# EAGLE schematic board (EAGLE 9.6.2)
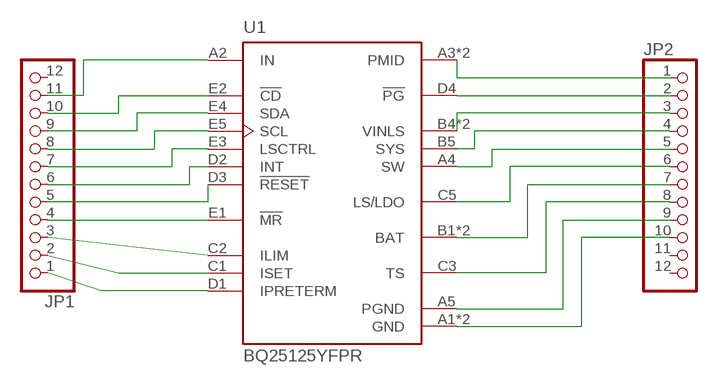
[diagram p0: schematic, sheet 1]

## Parts
JP1  PINHD-1X12  [1X12]
JP2  PINHD-1X12  [1X12]
U1  BQ25125YFPR  [BGA25N40P5X5_253X247X50N]

## Nets
N$1: JP1.1 U1.D1(IPRETERM)
N$2: JP1.2 U1.C1(ISET)
N$3: JP1.3 U1.C2(ILIM)
N$4: JP1.4 U1.E1(!MR)
N$5: JP1.5 U1.D3(!RESET)
N$6: JP1.6 U1.D2(INT)
N$7: JP1.7 U1.E3(LSCTRL)
N$8: JP1.8 U1.E5(SCL)
N$9: JP1.9 U1.E4(SDA)
N$10: JP1.10 U1.E2(!CD)
N$11: JP1.11 U1.A2(IN)
N$12: JP2.1 U1.A3(PMID) U1.B3(PMID)
N$13: JP2.2 U1.D4(!PG)
N$14: JP2.3 U1.B4(VINLS) U1.C4(VINLS)
N$15: JP2.4 U1.B5(SYS)
N$16: JP2.5 U1.A4(SW)
N$17: JP2.6 U1.C5(LS/LDO)
N$18: JP2.7 U1.B1(BAT) U1.B2(BAT)
N$19: JP2.8 U1.C3(TS)
N$20: JP2.9 U1.A5(PGND)
N$21: JP2.10 U1.A1(GND) U1.D5(GND)
Unconnected: JP1.12 JP2.11 JP2.12

## Library data of the parts
JP1 JP2 = adafruit:PINHD-1X12: PIN HEADER
U1 = BQ25125YFPR:BQ25125YFPR: Low IQ highly integrated battery charge management solution for wearables and IoT 25-DSBGA -40 to 85 Check availability <https://pricing.snapeda.com/parts/BQ25125YFPR/Texas%20Instruments/view-part?ref=eda>; AVAILABILITY: In Stock; DESCRIPTION: Low IQ highly integrated battery charge management solution for wearables and IoT; MF: Texas Instruments; MP: BQ25125YFPR; PACKAGE: DSBGA-25 Texas Instruments; PRICE: None; PURCHASE-URL: https://pricing.snapeda.com/search/part/BQ25125YFPR/?ref=eda